# EAGLE design PowerDistBoard (EAGLE 8.4.3)
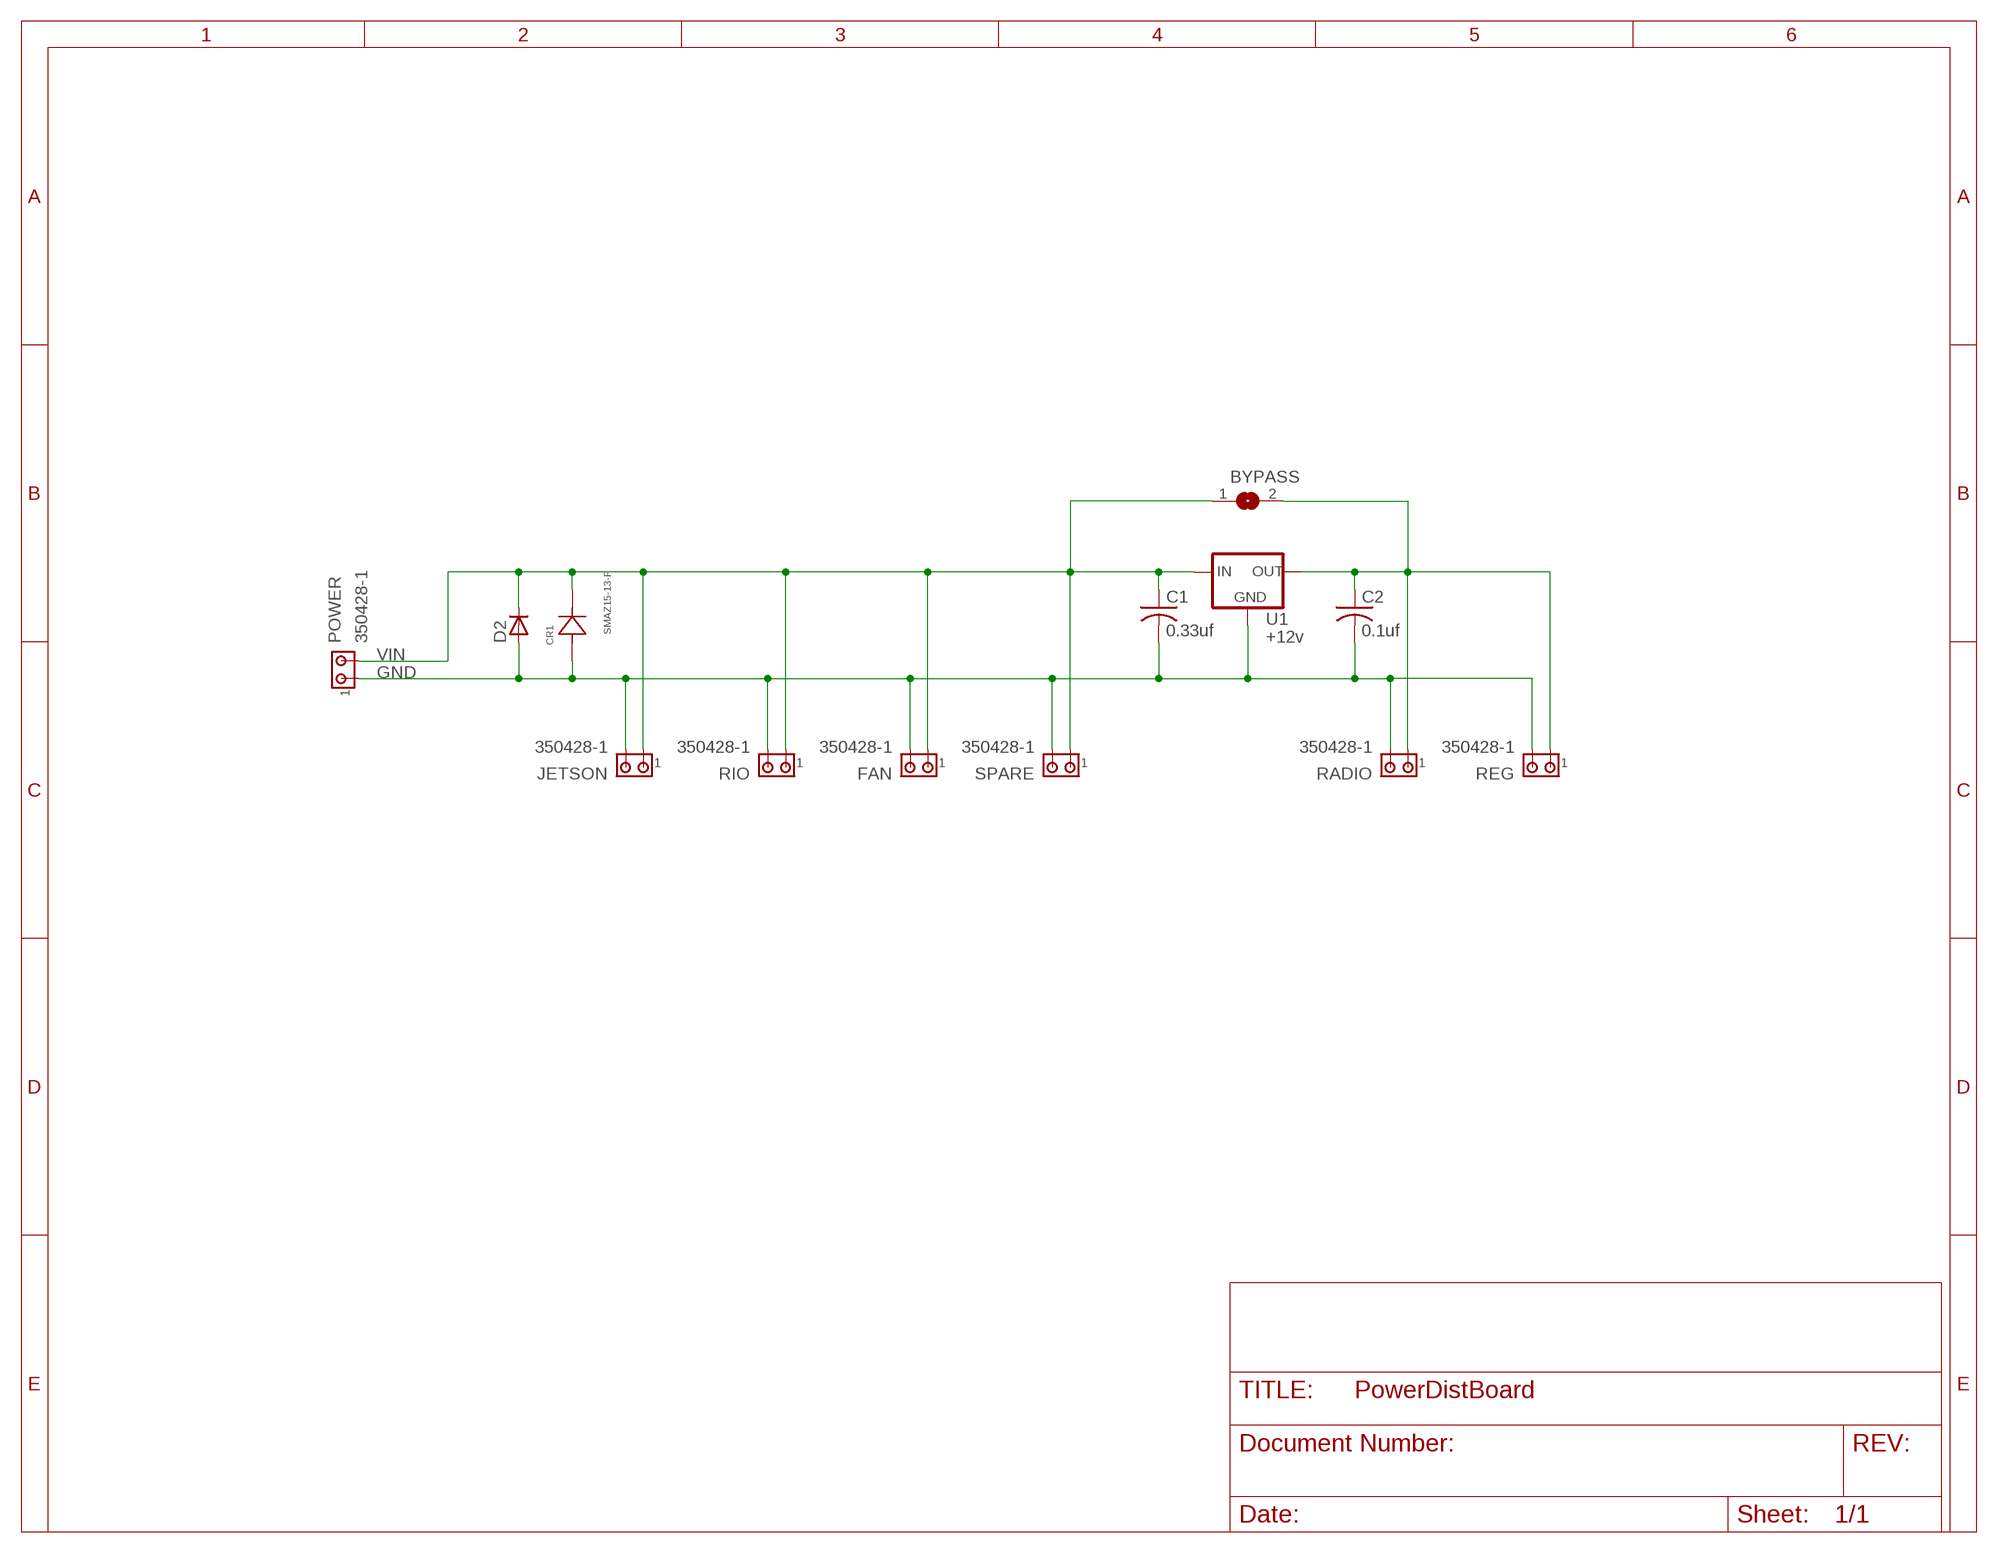
[diagram p0: schematic, sheet 1]

## Parts
BYPASS  SJW  [SJW]
C1  0.33uf  C-USC0603  [C0603]
C2  0.1uf  C-USC0603  [C0603]
CR1  SMAZ15-13-F  [SMA]
D2  D-SOD-80  [SOD80]
FAN  350428-1  [350428-1]
JETSON  350428-1  [350428-1]
POWER  350428-1  [350428-1]
RADIO  350428-1  [350428-1]
REG  350428-1  [350428-1]
RIO  350428-1  [350428-1]
SPARE  350428-1  [350428-1]
U1  +12v  V_REG_78XX7812  [TO-252]

## Nets
GND: C1.2 C2.2 CR1.2 D2.2(A) FAN.2 JETSON.2 POWER.1 RADIO.2 REG.2 RIO.2 SPARE.2 U1.3(GND)
N$1: BYPASS.2 C2.1 RADIO.1 REG.1 U1.2(OUT)
VIN: BYPASS.1 C1.1 CR1.1 D2.1(C) FAN.1 JETSON.1 POWER.2 RIO.1 SPARE.1 U1.1(IN)

## Library data of the parts
BYPASS = jumper:SJ: SMD solder JUMPER
C1 C2 = rcl:C-US: CAPACITOR, American symbol; SPICEPREFIX: C
CR1 = JetsonProj:SMAZ15-13-F; MANUFACTURER_PART_NUMBER: SMAZ1513F; VENDOR: Diodes Inc
D2 = semicon-smd-ipc:D-: DIODE unfilled
FAN JETSON POWER RADIO REG RIO SPARE = con-amp:350428-1: Universal MATE-N-LOK .250" Centerline, 600 V, 19 - 36 A max Source: http://catalog.tycoelectronics.com/ .. ENG_CD_350428_Y.pdf
U1 = SparkFun-IC-Power:V_REG_78XX: Voltage Regulator Standard 78xx regulator. IGO (Input Ground Output). Spark Fun Electronics SKU : COM-00107; PROD_ID: VREG-12370

## Board
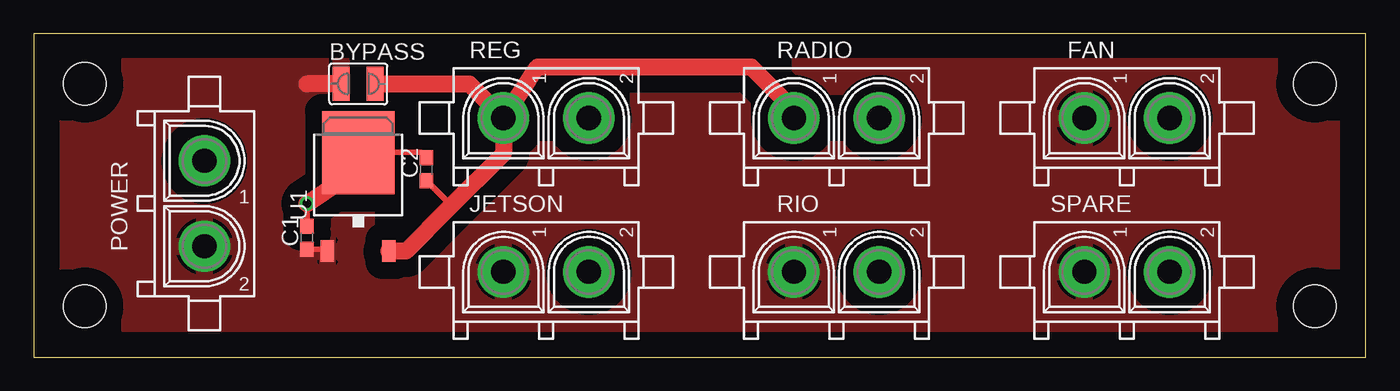
[diagram p1: board, top side]
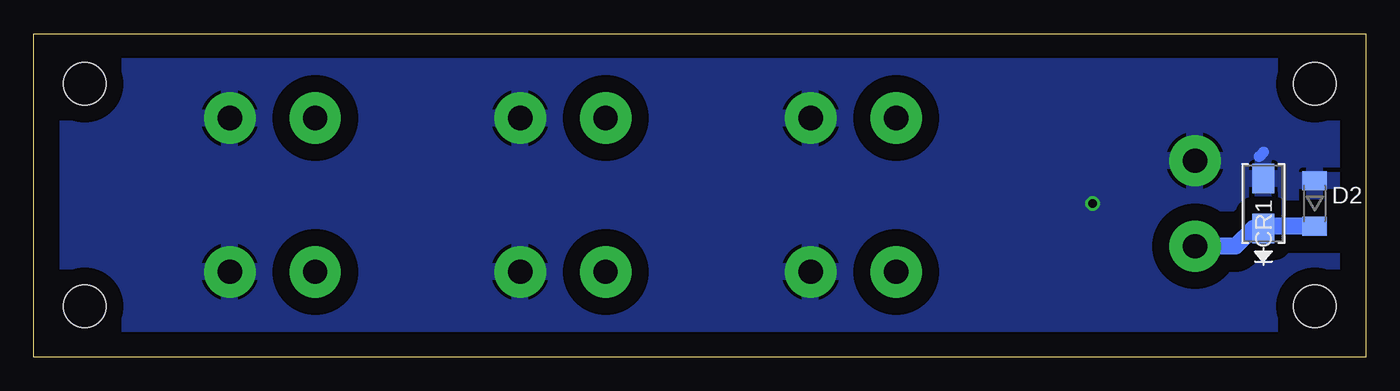
[diagram p2: board, bottom side, seen from below]

Size 99.04 x 24.05 mm. Coordinates in mm from the lower left corner, seen from the top.
Outline: 0,0 99.04,0 99.04,24.05 0,24.05 0,0
Copper layers (1*16): Top 0.035mm / dielectric 1.5mm / Bottom 0.035mm
Design rules "default": minimum track width 6mil, minimum drill 0.35mm, track to track 6mil, track to pad 6mil, pad to pad 6mil, via to via 6mil, smd to smd 6mil, copper to edge 40mil, drill to drill 6mil, minimum pad ring 10mil, minimum via ring 8mil, stop-mask expansion 4mil, vias tented up to drill 0mil, thermal gap 10mil
Holes 3.17 mm at 3.81,20.32 3.81,3.81 95.25,3.81 95.25,20.32

### Footprints (pad centres in the part's own frame; a part is rotated, then mirrored left to right if it is on the bottom)
SJW = smd 1.27 x 2.54: 1 -1.27,0; 2 1.27,0
C0603 = smd 1.1 x 1: 1 -0.85,0; 2 0.85,0
SMA = smd 2.18 x 1.63: 1 -1.857,0; 2 1.857,0
SOD80 = smd 1.4 x 1.8: 1 -1.7,0; 2 1.7,0
350428-1 = drill 1.8 pad 3.81: 1 -3.175,0; 2 3.175,0
TO-252 = smd 1 x 1.6: 1 -2.28,-4.8; 2 2.28,-4.8 | smd 5.4 x 6.2: 3 0,2.5

### Placement (x,y rotation side)
BYPASS  24.13,20.32 0 top
C1  20.32,8.89 90 top
C2  29.21,13.97 90 top
CR1  7.62,11.43 90 bottom
D2  3.81,11.43 90 bottom
FAN  81.28,17.78 0 top
JETSON  38.1,6.35 0 top
POWER  12.7,11.43 270 top
RADIO  59.69,17.78 0 top
REG  38.1,17.78 0 top
RIO  59.69,6.35 0 top
SPARE  81.28,6.35 0 top
U1  24.13,12.7 0 top

### Tracks (layer width: path | path; a pad name or v marks a point on that pad's centre or on a via)
GND  (via drill 0.65)
  Top 0.406: C2.2 28.79,15.24 25.4,15.24 25.36,15.2 U1.3 | C1.2 v20.32,11.43
  Top 1.27: U1.3 24.13,13.97 v20.32,11.43
  Bottom 0.813: 7.62,15.24 7.94,14.92
  pour Bottom (isolate 1.27): 2.54,21.59 96.52,21.59 96.52,2.54 2.54,2.54
N$1
  Top 0.406: C2.1 30.84,11.48 30.84,11.06
  Top 1.27: REG.1 34.92,15.14 30.84,11.06 27.68,7.9 U1.2 | REG.1 37.47,21.59 53.34,21.59 56.52,18.41 RADIO.1 | BYPASS.2 32.38,20.32 REG.1
VIN
  Top 0.406: C1.1 21.71,8.04 U1.1
  Top 1.27: BYPASS.1 20.32,20.32
  Bottom 1.27: POWER.2 9.7,8.26 8.38,9.57 CR1.1 7.46,9.73 D2.1
  pour Top (isolate 1.27): 2.54,2.54 96.52,2.54 96.52,21.59 2.54,21.59